# Altium schematic sheet YakupTrkn(block).SchDoc
size A4
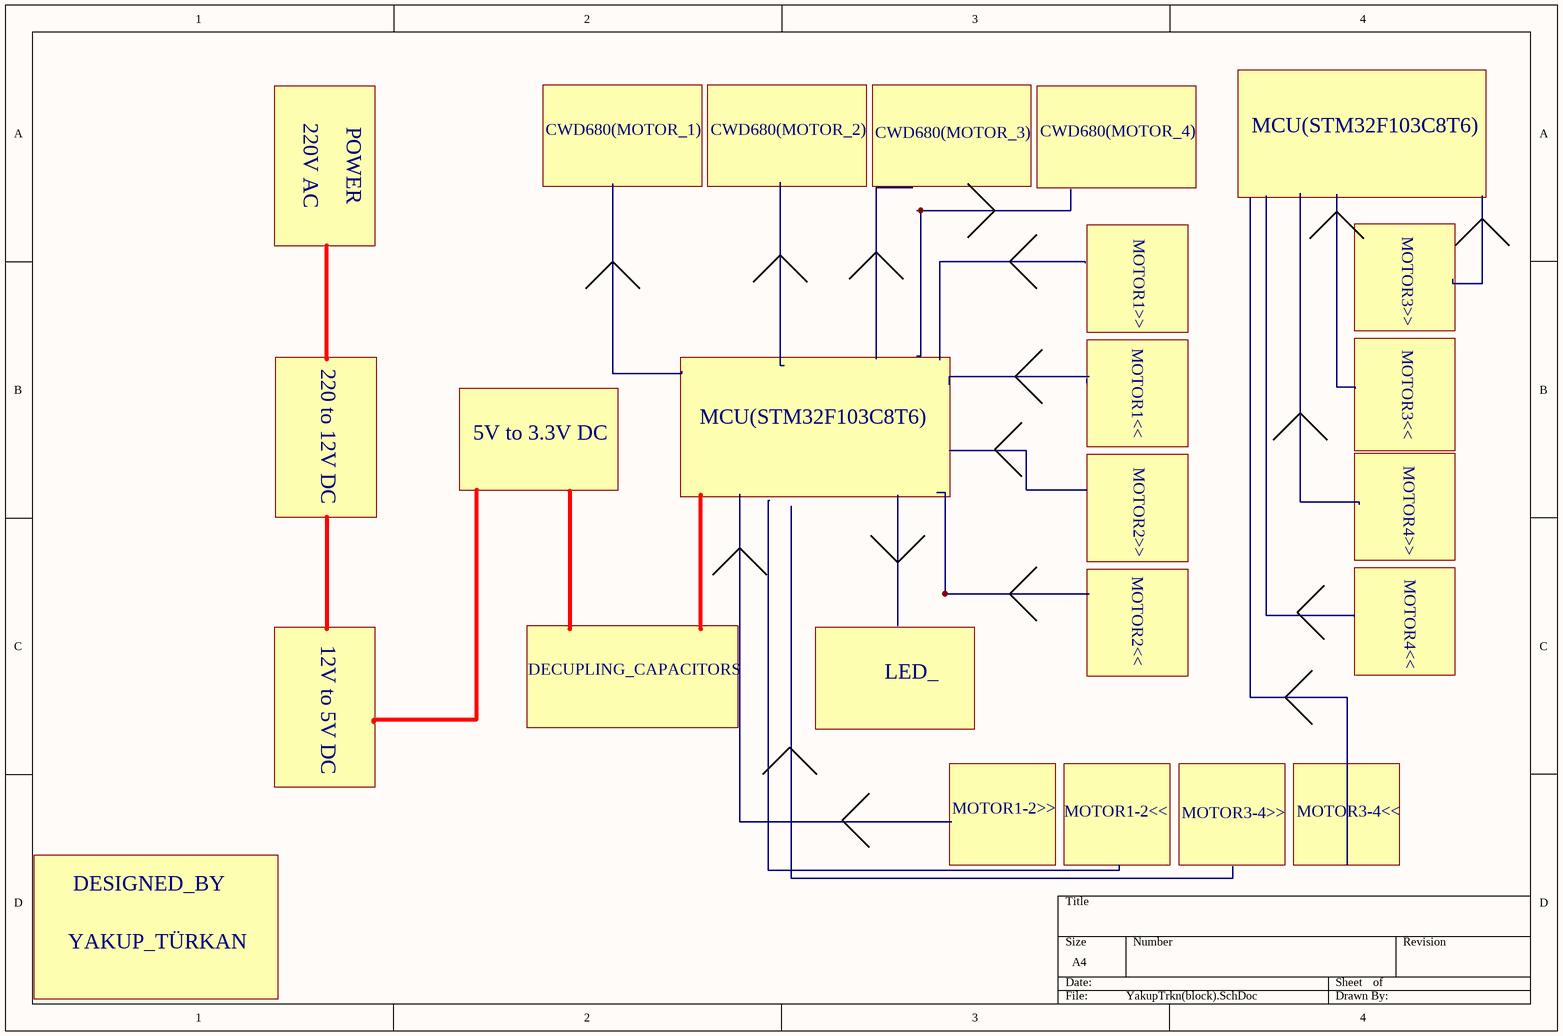
[diagram p0: YakupTrkn(block).SchDoc]

## Notes on the sheet
- 220V AC
- POWER
- CWD680(MOTOR_1)
- CWD680(MOTOR_2)
- CWD680(MOTOR_3)
- CWD680(MOTOR_4)
- MCU(STM32F103C8T6)
- MOTOR1>>
- MOTOR3>>
- 220 to 12V DC
- MOTOR1<<
- MOTOR3<<
- 5V to 3.3V DC
- MOTOR2>>
- MOTOR4>>
- MOTOR2<<
- MOTOR4<<
- 12V to 5V DC
- DECUPLING_CAPACITORS
- LED_
- MOTOR1-2>>
- MOTOR1-2<<
- MOTOR3-4>>
- MOTOR3-4<<
- DESIGNED_BY
- YAKUP_TÜRKAN